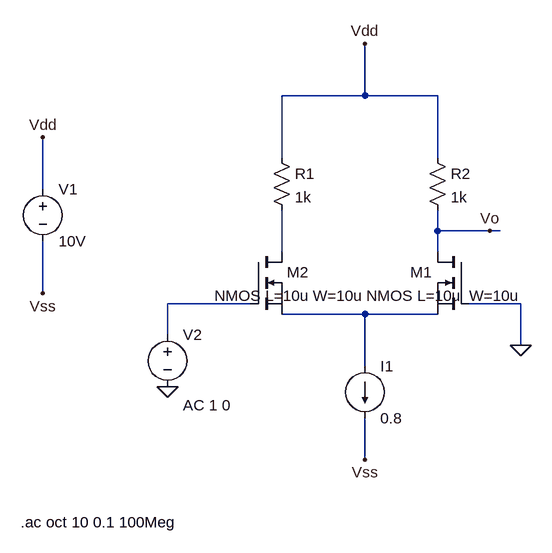
[diagram p0: schematic lab10_2.asc]
lab10_2.asc, the LTspice schematic file:
Version 4
SHEET 1 880 680
WIRE 144 -144 144 -224
WIRE 144 -144 16 -144
WIRE 256 -144 144 -144
WIRE 16 -48 16 -144
WIRE 256 -48 256 -144
WIRE -352 0 -352 -80
WIRE 256 64 256 32
WIRE 336 64 256 64
WIRE 352 64 336 64
WIRE 16 96 16 32
WIRE 256 96 256 64
WIRE -352 160 -352 80
WIRE -32 176 -160 176
WIRE 384 176 304 176
WIRE 144 192 16 192
WIRE 256 192 144 192
WIRE -160 224 -160 176
WIRE 384 240 384 176
WIRE 144 272 144 192
WIRE 144 416 144 352
FLAG 144 416 Vss
FLAG 144 -224 Vdd
FLAG 384 240 0
FLAG -352 -80 Vdd
FLAG -352 160 Vss
FLAG -160 304 0
FLAG 336 64 Vo
SYMBOL nmos 304 96 M0
WINDOW 3 -80 68 Left 2
SYMATTR InstName M1
SYMATTR Value NMOS L=10u  W=10u
SYMBOL nmos -32 96 R0
WINDOW 3 -56 68 Left 2
SYMATTR InstName M2
SYMATTR Value NMOS L=10u W=10u
SYMBOL res 0 -64 R0
SYMATTR InstName R1
SYMATTR Value 1k
SYMBOL res 240 -64 R0
SYMATTR InstName R2
SYMATTR Value 1k
SYMBOL current 144 272 R0
WINDOW 123 0 0 Left 2
WINDOW 39 0 0 Left 2
SYMATTR InstName I1
SYMATTR Value 0.8
SYMBOL voltage -352 -16 R0
WINDOW 123 0 0 Left 2
WINDOW 39 0 0 Left 2
SYMATTR InstName V1
SYMATTR Value 10V
SYMBOL voltage -160 208 R0
WINDOW 123 24 124 Left 2
WINDOW 39 0 0 Left 2
SYMATTR InstName V2
SYMATTR Value ""
SYMATTR Value2 AC 1 0
TEXT -386 512 Left 2 !.ac oct 10 0.1 100Meg

The netlist it stands for:
* lab10_2.asc
M1 Vo 0 N003 N003 NMOS L=10u  W=10u
M2 N001 N002 N003 N003 NMOS L=10u W=10u
R1 Vdd N001 1k
R2 Vdd Vo 1k
I1 N003 Vss 0.8
V1 Vdd Vss 10V
V2 N002 0 AC 1 0
.model NMOS NMOS
.model PMOS PMOS
.lib standard.mos
.ac oct 10 0.1 100Meg
.backanno
.end